# Altium schematic sheet Gate Driver Interface.SchDoc
size B
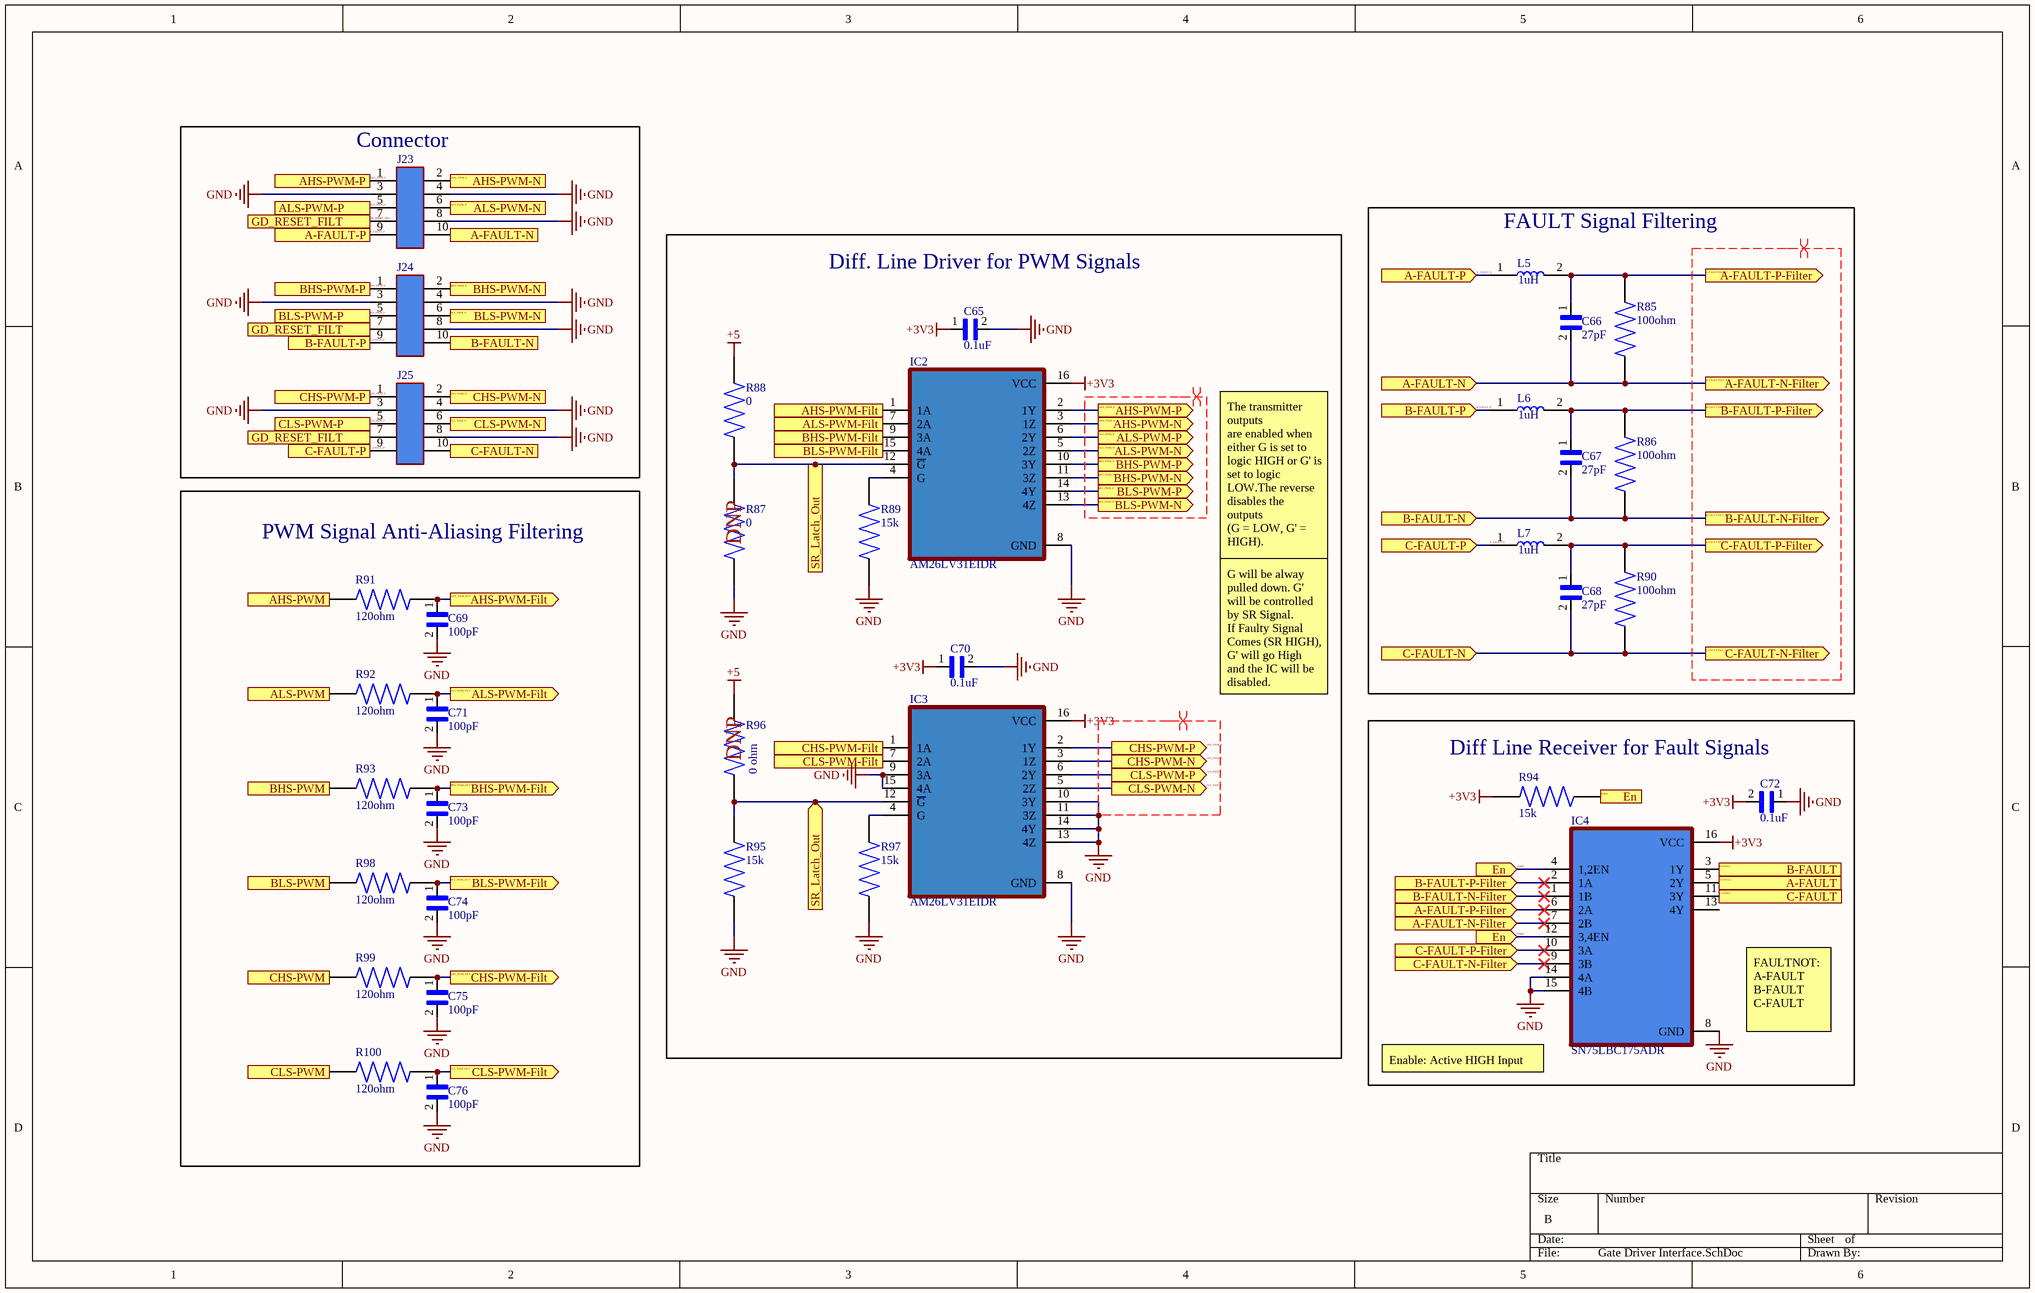
[diagram p0: Gate Driver Interface.SchDoc]

## Parts
C65  0.1uF  [CAP 0805(2012 metric)]
C66  27pF  [CAP 0805(2012 metric)]
C67  27pF  [CAP 0805(2012 metric)]
C68  27pF  [CAP 0805(2012 metric)]
C69  100pF  [CAP 0805(2012 metric)]
C70  0.1uF  [CAP 0805(2012 metric)]
C71  100pF  [CAP 0805(2012 metric)]
C72  0.1uF  [CAP 0805(2012 metric)]
C73  100pF  [CAP 0805(2012 metric)]
C74  100pF  [CAP 0805(2012 metric)]
C75  100pF  [CAP 0805(2012 metric)]
C76  100pF  [CAP 0805(2012 metric)]
IC2  AM26LV31EIDR  [SOIC127P600X175-16N]
IC3  AM26LV31EIDR  [SOIC127P600X175-16N]
IC4  SN75LBC175ADR  [SN75LBC175ADR]
J23  2ROW10POS  [2ROW10POS]  (value not drawn)
J24  2ROW10POS  [2ROW10POS]  (value not drawn)
J25  2ROW10POS  [2ROW10POS]  (value not drawn)
L5  1uH  [IND 0805]
L6  1uH  [IND 0805]
L7  1uH  [IND 0805]
R85  100ohm  [RES 0805(2012 metric)]
R86  100ohm  [RES 0805(2012 metric)]
R87  0  [RES 0805(2012 metric)]
R88  0  [RES 0805(2012 metric)]
R89  15k  [RES 0805(2012 metric)]
R90  100ohm  [RES 0805(2012 metric)]
R91  120ohm  [RES 0805(2012 metric)]
R92  120ohm  [RES 0805(2012 metric)]
R93  120ohm  [RES 0805(2012 metric)]
R94  15k  [RES 0805(2012 metric)]
R95  15k  [RES 0805(2012 metric)]
R96  0 ohm  [RES 0805(2012 metric)]
R97  15k  [RES 0805(2012 metric)]
R98  120ohm  [RES 0805(2012 metric)]
R99  120ohm  [RES 0805(2012 metric)]
R100  120ohm  [RES 0805(2012 metric)]

## Blocks framed on the sheet
Connector: J23-J25
FAULT Signal Filtering: C66-C68 L5-L7 R85 R86 R90
PWM Signal Anti-Aliasing Filtering: C69 C71 C73-C76 R91-R93 R98-R100
Diff Line Receiver for Fault Signals: C72 IC4 R94

## Ports
A-FAULT (out), A-FAULT-N (in), A-FAULT-N (out), A-FAULT-N-Filter (in), A-FAULT-N-Filter (out), A-FAULT-P (in), A-FAULT-P (out), A-FAULT-P-Filter (in), A-FAULT-P-Filter (out), AHS-PWM (in), AHS-PWM-Filt (in), AHS-PWM-Filt (out), AHS-PWM-N (in), AHS-PWM-N (out), AHS-PWM-P (in), AHS-PWM-P (out), ALS-PWM (in), ALS-PWM-Filt (in), ALS-PWM-Filt (out), ALS-PWM-N (in), ALS-PWM-N (out), ALS-PWM-P (in), ALS-PWM-P (out), B-FAULT (out), B-FAULT-N (in), B-FAULT-N (out), B-FAULT-N-Filter (in), B-FAULT-N-Filter (out), B-FAULT-P (in), B-FAULT-P (out), B-FAULT-P-Filter (in), B-FAULT-P-Filter (out), BHS-PWM (in), BHS-PWM-Filt (in), BHS-PWM-Filt (out), BHS-PWM-N (in), BHS-PWM-N (out), BHS-PWM-P (in), BHS-PWM-P (out), BLS-PWM (in), BLS-PWM-Filt (in), BLS-PWM-Filt (out), BLS-PWM-N (in), BLS-PWM-N (out), BLS-PWM-P (in), BLS-PWM-P (out), C-FAULT (out), C-FAULT-N (in), C-FAULT-N (out), C-FAULT-N-Filter (in), C-FAULT-N-Filter (out), C-FAULT-P (in), C-FAULT-P (out), C-FAULT-P-Filter (in), C-FAULT-P-Filter (out), CHS-PWM (in), CHS-PWM-Filt (in), CHS-PWM-Filt (out), CHS-PWM-N (in), CHS-PWM-N (out), CHS-PWM-P (in), CHS-PWM-P (out), CLS-PWM (in), CLS-PWM-Filt (in), CLS-PWM-Filt (out), CLS-PWM-N (in), CLS-PWM-N (out), CLS-PWM-P (in), CLS-PWM-P (out), En (in), En (out), GD_RESET_FILT (in), SR_Latch_Out (in)

## Nets
+3V3: C65.1 C70.1 C72.2 IC2.16(VCC) IC3.16(VCC) IC4.16(VCC) R94.2
+5: R88.2 R96.2
GND: C65.2 C69.2 C70.2 C71.2 C72.1 C73.2 C74.2 C75.2 C76.2 IC2.8(GND) IC3.8(GND) IC3.9(3A) IC3.10(3Y) IC3.11(3Z) IC3.13(4Z) IC3.14(4Y) IC3.15(4A) IC4.8(GND) IC4.14(4A) IC4.15(4B) J23.3 J23.4 J23.8 J24.3 J24.4 J24.8 J25.3 J25.4 J25.8 R87.1 R89.1 R95.1 R97.1
A-FAULT: IC4.5(2Y) ; port A-FAULT
A-FAULT-FILT_N: C66.2 IC4.7(2B) J23.10 R85.1 ; port A-FAULT-N, port A-FAULT-N-Filter
A-FAULT-FILT_P: C66.1 IC4.6(2A) L5.2 R85.2 ; port A-FAULT-P-Filter
A_FAULT_P: J23.9 L5.1 ; port A-FAULT-P
AHS-PWM: R91.1 ; port AHS-PWM
AHS_PWM_FILT: C69.1 IC2.1(1A) R91.2 ; port AHS-PWM-Filt
AHS_PWM_N: IC2.3(1Z) J23.2 ; port AHS-PWM-N
AHS_PWM_P: IC2.2(1Y) J23.1 ; port AHS-PWM-P
ALS-PWM: R92.1 ; port ALS-PWM
ALS_PWM_FILT: C71.1 IC2.7(2A) R92.2 ; port ALS-PWM-Filt
ALS_PWM_N: IC2.5(2Z) J23.6 ; port ALS-PWM-N
ALS_PWM_P: IC2.6(2Y) J23.5 ; port ALS-PWM-P
B-FAULT: IC4.3(1Y) ; port B-FAULT
B-FAULT-FILT_N: C67.2 IC4.1(1B) J24.10 R86.1 ; port B-FAULT-N, port B-FAULT-N-Filter
B-FAULT-FILT_P: C67.1 IC4.2(1A) L6.2 R86.2 ; port B-FAULT-P-Filter
B_FAULT_P: J24.9 L6.1 ; port B-FAULT-P
BHS-PWM: R93.1 ; port BHS-PWM
BHS_PWM_FILT: C73.1 IC2.9(3A) R93.2 ; port BHS-PWM-Filt
BHS_PWM_N: IC2.11(3Z) J24.2 ; port BHS-PWM-N
BHS_PWM_P: IC2.10(3Y) J24.1 ; port BHS-PWM-P
BLS-PWM: R98.1 ; port BLS-PWM
BLS_PWM_FILT: C74.1 IC2.15(4A) R98.2 ; port BLS-PWM-Filt
BLS_PWM_N: IC2.13(4Z) J24.6 ; port BLS-PWM-N
BLS_PWM_P: IC2.14(4Y) J24.5 ; port BLS-PWM-P
C-FAULT: IC4.11(3Y) ; port C-FAULT
C-FAULT-FILT_N: C68.2 IC4.9(3B) J25.10 R90.1 ; port C-FAULT-N, port C-FAULT-N-Filter
C-FAULT-FILT_P: C68.1 IC4.10(3A) L7.2 R90.2 ; port C-FAULT-P-Filter
C_FAULT_P: J25.9 L7.1 ; port C-FAULT-P
CHS-PWM: R99.1 ; port CHS-PWM
CHS_PWM_FILT: C75.1 IC3.1(1A) R99.2 ; port CHS-PWM-Filt
CHS_PWM_N: IC3.3(1Z) J25.2 ; port CHS-PWM-N
CHS_PWM_P: IC3.2(1Y) J25.1 ; port CHS-PWM-P
CLS-PWM: R100.1 ; port CLS-PWM
CLS_PWM_FILT: C76.1 IC3.7(2A) R100.2 ; port CLS-PWM-Filt
CLS_PWM_N: IC3.5(2Z) J25.6 ; port CLS-PWM-N
CLS_PWM_P: IC3.6(2Y) J25.5 ; port CLS-PWM-P
enable: IC4.4(1,2EN) IC4.12(3,4EN) R94.1 ; port En
GD_RESET_FILT: J23.7 J24.7 J25.7 ; port GD_RESET_FILT
SR_Latch_Out: IC2.12(~{G}) IC3.12(~{G}) R87.2 R88.1 R95.2 R96.1 ; port SR_Latch_Out
NetIC2_4: IC2.4(G) R89.2
NetIC3_4: IC3.4(G) R97.2

Not connected (* = marked no-connect by the designer): IC4 13(4Y)

## Layout directives
differential pair; differential pair class DIFF90: A-FAULT-FILT_N, A-FAULT-FILT_P, AHS_PWM_N, AHS_PWM_P, ALS_PWM_N, ALS_PWM_P, B-FAULT-FILT_N, B-FAULT-FILT_P, BHS_PWM_N, BHS_PWM_P, BLS_PWM_N, BLS_PWM_P, C-FAULT-FILT_N, C-FAULT-FILT_P, CHS_PWM_N, CHS_PWM_P, CLS_PWM_N, CLS_PWM_P

## Notes on the sheet
- Diff. Line Driver for PWM Signals
- (near R87) DNP
- The transmitter outputs
  are enabled when either G is set to logic HIGH or G' is set to logic LOW.The reverse disables the outputs
  (G = LOW, G' = HIGH).
- G will be alway pulled down. G' will be controlled by SR Signal.
  If Faulty Signal Comes (SR HIGH), G' will go High and the IC will be disabled.
- (near R96) DNP
- FAULTNOT:  A-FAULT B-FAULT C-FAULT
- (near IC4) Enable: Active HIGH Input

## Library data of the parts
C65 C70 C72 = 0.1uF 25V 0805: 0.1µF ±10% 25V Ceramic Capacitor X7R 0805 (2012Metric)
C66-C68 = 27pF 50V: CL10 Series 27 pF 50 V ±5 % Tolerance
C69 C71 C73-C76 = 100pF 50V: 100pF ±5% 50V Ceramic Capacitor C0G, NP0 0805 (2012 Metric)
L5-L7 = 1uH 0805: 1µH Shielded Multilayer Inductor 1.15A 60mOhm 0805 (2012 Metric)
R85 R86 R90 = 100ohm 0.1W: 100 Ohms ±1% 0.1W, 1/10W Chip Resistor 0805(2012 Metric) Moisture Resistant Thick Film
R87-R89 R94 R95 R97 = 15k 0805: 15k 0805 0.1W
R91-R93 R98-R100 = 120ohm 0805: 120 Ohms ±5% 0.1W, 1/10W Chip Resistor 0805 (2012 Metric) Moisture Resistant Thick Film
R96 = 0ohm 0805: 0 ohm 0805 res